# EAGLE design OptoBidirectional (EAGLE 7.2.0)
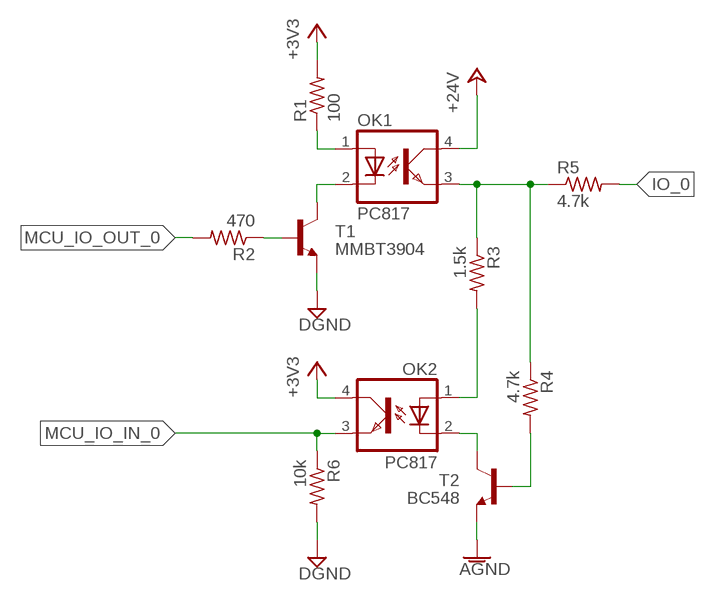
[diagram p0: schematic, sheet 1]

## Parts
OK1  PC817  [DIL04]
OK2  PC817  [DIL04]
R1  100  R-US_0204/7  [0204/7]
R2  470  R-US_R0402  [R0402]
R3  1.5k  R-US_0204/5  [0204/5]
R4  4.7k  R-US_0204/2V  [0204V]
R5  4.7k  R-US_0204/2V  [0204V]
R6  10k  R-US_0204/5  [0204/5]
T1  MMBT3904  MMBT3904LT1-NPN-SOT23-BEC  [SOT23-BEC]
T2  BC548  BC548-NPN-TO92-CBE  [TO92-CBE]

## Nets
+3V3: OK2.4(COL) R1.2
+24V: OK1.4(COL)
AGND: T2.E
DGND: R6.2 T1.E
IO_0: R5.2
MCU_IO_IN_0: OK2.3(EMIT) R6.1
MCU_IO_OUT_0: R2.2
N$1: OK2.2(C) T2.C
N$2: OK1.2(C) T1.C
N$3: R2.1 T1.B
N$4: OK1.1(A) R1.1
N$7: OK1.3(EMIT) R3.1 R4.1 R5.1
N$8: OK2.1(A) R3.2
N$9: R4.2 T2.B

## Library data of the parts
OK1 OK2 = optocoupler:PC817: SHARP OPTO COUPLER; MPN: PC817X4J000F; OC_FARNELL: 9707727; OC_NEWARK: 97K7059
R1-R6 = rcl:R-US_: RESISTOR, American symbol
T1 T2 = transistor:*-NPN-: NPN Transistror BF959 corrected 2008.03.06

## Board
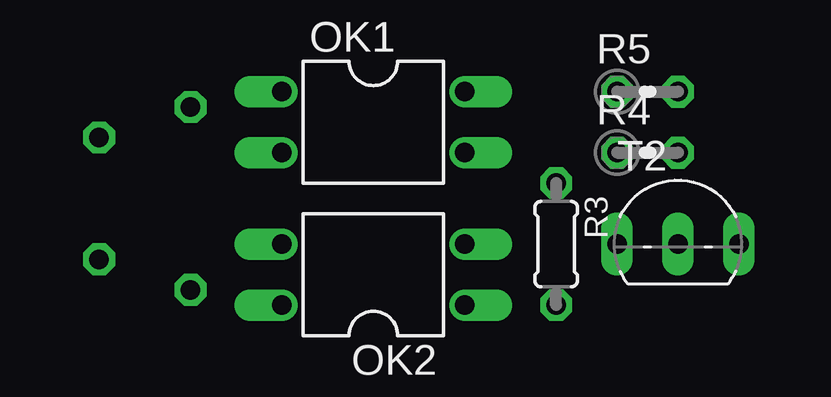
[diagram p1: board, top side]
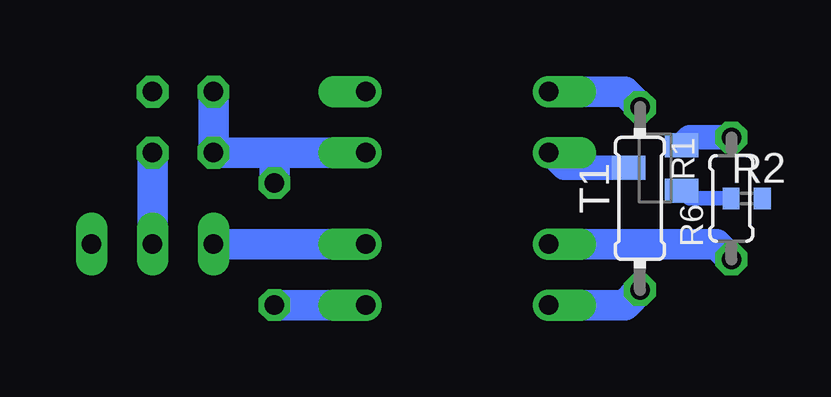
[diagram p2: board, bottom side, seen from below]

No outline drawn. Coordinates in mm, seen from the top.
Copper layers (1*16): Top 0.035mm / dielectric 1.5mm / Bottom 0.035mm
Design rules "default": minimum track width 10mil, minimum drill 24mil, track to track 8mil, track to pad 8mil, pad to pad 8mil, via to via 8mil, smd to smd 8mil, copper to edge 40mil, drill to drill 8mil, minimum pad ring 10mil, minimum via ring 8mil, stop-mask expansion 4mil, vias tented up to drill 0mil, thermal gap 10mil

### Footprints (pad centres in the part's own frame; a part is rotated, then mirrored left to right if it is on the bottom)
DIL04 = drill 0.813 offset: 1 -1.27,-3.81; 2 1.27,-3.81; 3 1.27,3.81; 4 -1.27,3.81
0204/7 = drill 0.813 octagon: 1 -3.81,0; 2 3.81,0
R0402 = smd 0.7 x 0.9: 1 -0.65,0; 2 0.65,0
0204/5 = drill 0.813 octagon: 1 -2.54,0; 2 2.54,0
0204V = drill 0.813 octagon: 1 -1.27,0; 2 1.27,0
SOT23-BEC = smd 1 x 1.4: B -0.95,-1.1; C 0,1.1; E 0.95,-1.1
TO92-CBE = drill 0.813 long: B 0,0; C -2.54,0; E 2.54,0

### Placement (x,y rotation side)
OK1  0,3.17 270 top
OK2  0,-3.17 90 top
R1  -7.62,0 270 bottom
R2  -12.06,0 0 bottom
R3  7.62,-1.91 270 top
R4  11.43,1.91 0 top
R5  11.43,4.45 0 top
R6  -11.43,0 90 bottom
T1  -8.26,1.27 90 bottom
T2  12.7,-1.91 0 top

### Tracks (layer width: path | path; a pad name or v marks a point on that pad's centre or on a via)
+3V3
  Bottom 1.27: R1.2 -6.99,-4.45 OK2.4
DGND
  Bottom 1.016: R6.2 -9.68,2.54 T1.E
MCU_IO_IN_0
  Bottom 1.27: OK2.3 -10.79,-1.91 R6.1
N$1
  Bottom 1.27: T2.C OK2.2
N$2
  Bottom 1.016: T1.C -4.45,1.27 OK1.2
N$3
  Bottom 0.61: T1.B -9.68,0 R2.1
N$4
  Bottom 1.27: R1.1 -6.99,4.45 OK1.1
N$7
  Bottom 1.27: OK1.3 7.62,1.91 | 7.62,1.91 R4.1 R5.1 | R3.1 7.62,1.91
N$8
  Bottom 1.27: OK2.1 R3.2
N$9
  Bottom 1.27: R4.2 T2.B